# EAGLE schematic BG7TBL 6GHz Prescaler (EAGLE 7.6.0)
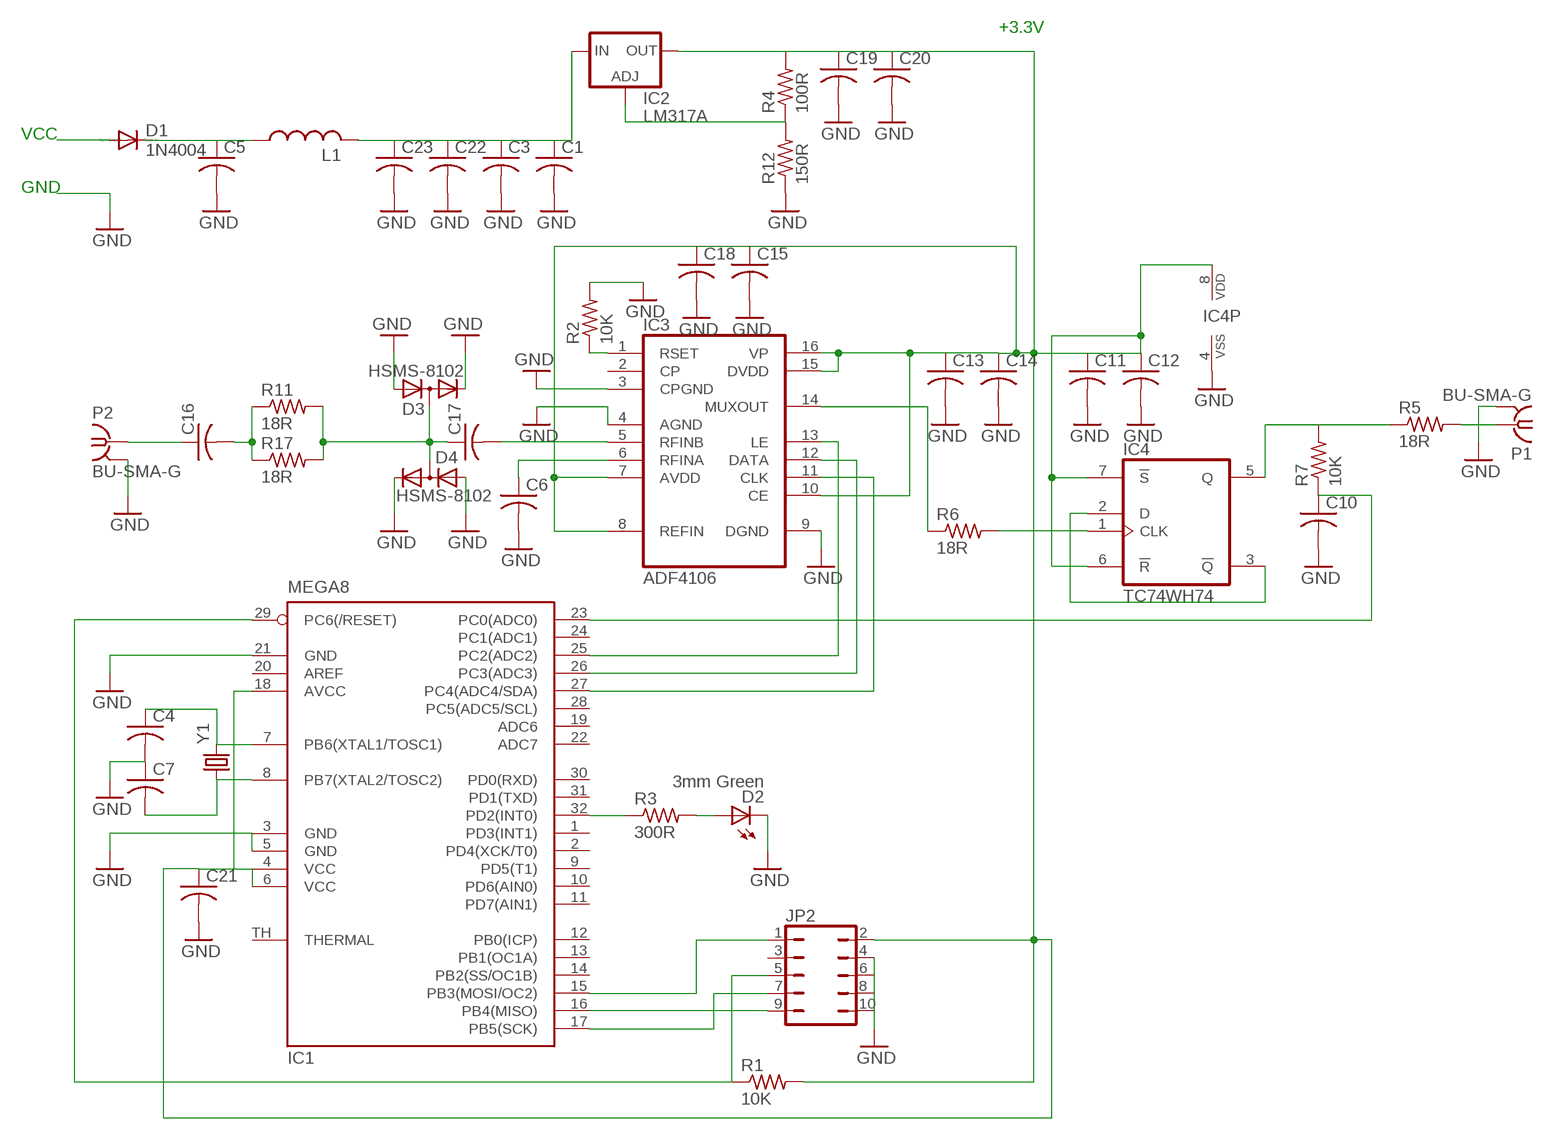
[diagram p0: schematic, sheet 1]

## Parts
C1  C-US025-024X044  [C025-024X044]
C3  C-US025-024X044  [C025-024X044]
C4  C-US025-024X044  [C025-024X044]
C5  C-US025-024X044  [C025-024X044]
C6  C-US025-024X044  [C025-024X044]
C7  C-US025-024X044  [C025-024X044]
C10  C-US025-024X044  [C025-024X044]
C11  C-US025-024X044  [C025-024X044]
C12  C-US025-024X044  [C025-024X044]
C13  C-US025-024X044  [C025-024X044]
C14  C-US025-024X044  [C025-024X044]
C15  C-US025-024X044  [C025-024X044]
C16  C-US025-024X044  [C025-024X044]
C17  C-US025-024X044  [C025-024X044]
C18  C-US025-024X044  [C025-024X044]
C19  C-US025-024X044  [C025-024X044]
C20  C-US025-024X044  [C025-024X044]
C21  C-US025-024X044  [C025-024X044]
C22  C-US025-024X044  [C025-024X044]
C23  C-US025-024X044  [C025-024X044]
D1  1N4004  [DO41-10]
D2  3mm Green  TLLG4400  [LED3MM]
D3  HSMS-8102  HSMS-2852  [SOT23]
D4  HSMS-8102  HSMS-2852  [SOT23]
IC1  MEGA8  MEGA8-MI  [MLF32-TH]
IC2  LM317A  LM317MBSTT3  [SOT223]
IC3  ADF4106  ADF4106D  [SO16]
IC4  TC74WH74  [SO08]
JP2  JP5Q  [JP5Q]
L1  L-US0204/5  [0204/5]
P1  BU-SMA-G  [BU-SMA-G]
P2  BU-SMA-G  [BU-SMA-G]
R1  10K  R-US_0204/2V  [0204V]
R2  10K  R-US_0204/2V  [0204V]
R3  300R  R-US_0204/2V  [0204V]
R4  100R  R-US_0204/2V  [0204V]
R5  18R  R-US_0204/2V  [0204V]
R6  18R  R-US_0204/2V  [0204V]
R7  10K  R-US_0204/2V  [0204V]
R11  18R  R-US_0204/2V  [0204V]
R12  150R  R-US_0204/2V  [0204V]
R17  18R  R-US_0204/2V  [0204V]
Y1  CRYSTALHC18U-H  [HC18U-H]

## Nets
GND: C1.2 C3.2 C4.2 C5.2 C6.2 C7.1 C10.2 C11.2 C12.2 C13.2 C14.2 C15.2 C18.2 C19.2 C20.2 C21.2 C22.2 C23.2 D2.K(C) D3.1(A) D3.2(C) D4.1(A) D4.2(C) IC1.3(GND) IC1.5(GND) IC1.21(GND) IC3.3(CPGND) IC3.4(AGND) IC3.9(DGND) IC4.4(VSS) JP2.4 JP2.6 JP2.8 JP2.10 P1.2 P1.3 P1.4 P1.5 P2.2 P2.3 P2.4 P2.5 R2.2 R12.1
N$1: C6.1 IC3.6(RFINA)
N$2: C17.2 IC3.5(RFINB)
N$3: C17.1 D3.3(AC) D4.3(AC) R11.2 R17.2
N$4: IC1.25(PC2(ADC2)) IC3.13(LE)
N$5: IC1.26(PC3(ADC3)) IC3.12(DATA)
N$6: IC1.27(PC4(ADC4/SDA)) IC3.11(CLK)
N$7: C7.2 IC1.8(PB7(XTAL2/TOSC2)) Y1.1
N$8: C16.2 R11.1 R17.1
N$9: C16.1 P2.1
N$10: C4.1 IC1.7(PB6(XTAL1/TOSC1)) Y1.2
N$11: IC1.16(PB4(MISO)) JP2.9
N$12: IC3.1(RSET) R2.1
N$13: C11.1 C13.1 C14.1 C15.1 C18.1 C19.1 C20.1 C21.1 IC1.4(VCC) IC1.6(VCC) IC1.18(AVCC) IC2.4(OUT) IC3.7(AVDD) IC3.8(REFIN) IC3.10(CE) IC3.15(DVDD) IC3.16(VP) IC4.6(!R) IC4.7(!S) IC4.8(VDD) JP2.2 R1.2 R4.2
N$14: IC3.14(MUXOUT) R6.1
N$15: IC4.1(CLK) R6.2
N$16: IC4.2(D) IC4.3(!Q)
N$17: D1.C L1.1
N$18: C10.1 IC1.23(PC0(ADC0)) R7.1
N$19: IC4.5(Q) R5.1 R7.2
N$20: P1.1 R5.2
N$21: IC1.17(PB5(SCK)) JP2.7
N$22: IC1.15(PB3(MOSI/OC2)) JP2.1
N$23: IC1.29(PC6(/RESET)) JP2.5 R1.1
N$24: IC1.32(PD2(INT0)) R3.1
N$25: D2.A R3.2
N$26: C1.1 C3.1 C22.1 C23.1 IC2.3(IN) L1.2
N$27: D1.A
N$28: IC2.1(ADJ) R4.1 R12.2
Unconnected: C5.1 C12.1 IC1.1(PD3(INT1)) IC1.2(PD4(XCK/T0)) IC1.9(PD5(T1)) IC1.10(PD6(AIN0)) IC1.11(PD7(AIN1)) IC1.12(PB0(ICP)) IC1.13(PB1(OC1A)) IC1.14(PB2(SS/OC1B)) IC1.19(ADC6) IC1.20(AREF) IC1.22(ADC7) IC1.24(PC1(ADC1)) IC1.28(PC5(ADC5/SCL)) IC1.30(PD0(RXD)) IC1.31(PD1(TXD)) IC1.TH(THERMAL) IC3.2(CP) JP2.3

## Notes on the sheet
- +3.3V
- VCC
- GND

## Library data of the parts
C1 C3-C7 C10-C23 = rcl:C-US: CAPACITOR, American symbol
D1 = diode:1N4004: DIODE general purpose rectifier, 1 A
D2 = led:TLLG4400: Low Current (2mA) LED 3 mm Tinted Diffused Package color GREEN Source: Data sheet <http://www.farnell.com/datasheets/391098.pdf>; MF: VISHAY SEMICONDUCTOR; OC_FARNELL: 1612435
D3 D4 = avago:HSMS-2852: Surface Mount Microwave Schottky Detector Diodes Source: Data sheet <http://www.farnell.com/datasheets/461166.pdf>
IC1 = atmel:MEGA8-MI: MICROCONTROLLER 8 Kbytes FLASH, 1 kbytes SRAM, 512 bytes EEPROM, USART, 6-channel 10 bit ADC, 2-channel 8 bit ADC Pin compatible with Atmega48, ATMega88, ATMega168 Source: avr.lbr; MPN: ATMEGA88PA-MU; OC_FARNELL: 1715491; OC_NEWARK: 15R0272
IC2 = v-reg:LM317?*: 500 mA Adjustable Output Positive Voltage Regulator Source: http://www.onsemi.co.jp .. LM317M-D.PDF
IC3 = custom:ADF4106: Micropower PLL
IC4 = custom:TC74WH74: Dual D FLIP FLOP, set/reset
JP2 = jumper:JP5Q: JUMPER
L1 = rcl:L-US: INDUCTOR, American symbol
P1 P2 = con-coax:BU-SMA-G: FEMALE SMA CONNECTOR Radiall distributor RS 193-9117; OC_FARNELL: unknown; OC_NEWARK: unknown
R1-R7 R11 R12 R17 = resistor:R-US_: RESISTOR, American symbol
Y1 = crystal:CRYSTAL: CRYSTAL; OC_FARNELL: unknown; OC_NEWARK: unknown